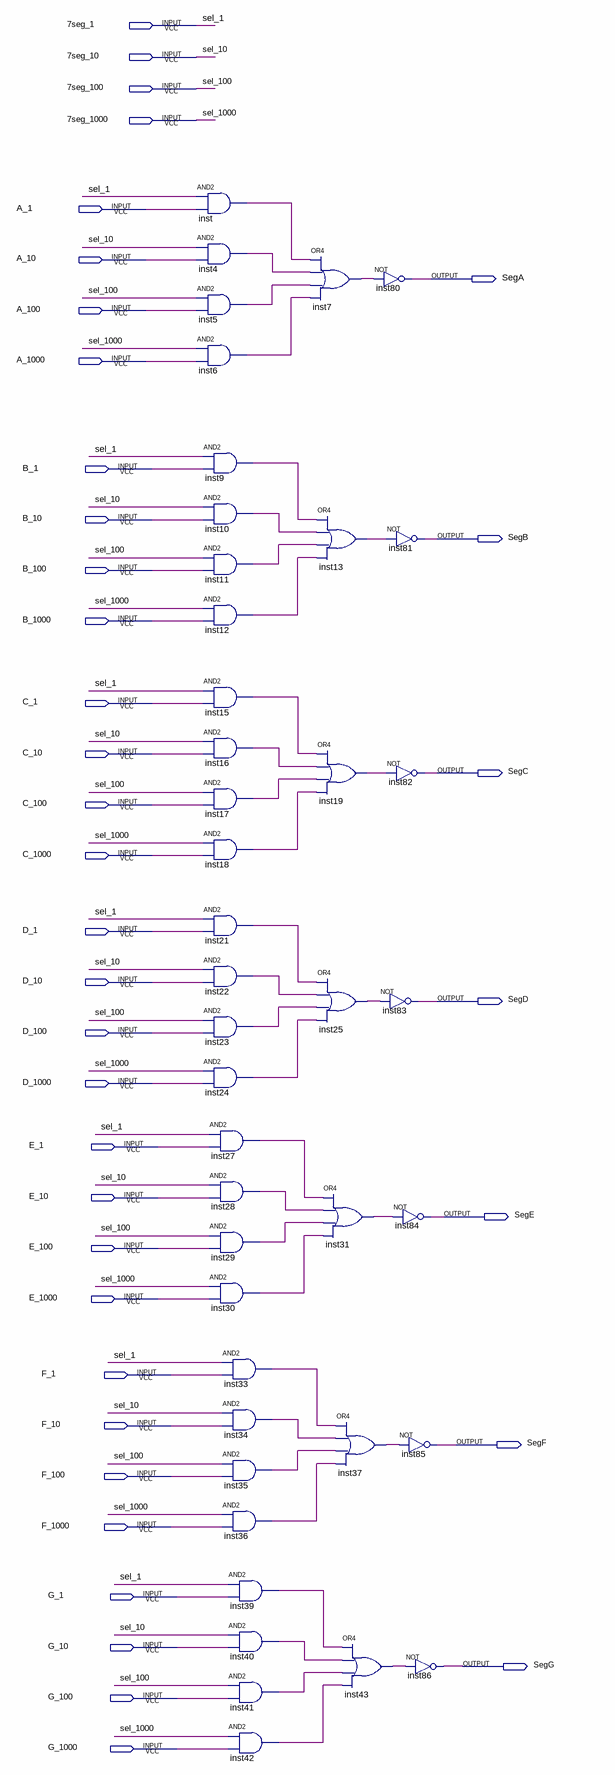
[diagram p0: schematic sheet]
// Quartus schematic Multiplexador.bdf as structural Verilog: 42 symbols, 39 pins
module Multiplexador (
  input  \7seg_1 ,
  input  \7seg_10 ,
  input  \7seg_100 ,
  input  \7seg_1000 ,
  input  A_1,
  input  A_10,
  input  A_100,
  input  A_1000,
  input  B_1,
  input  B_10,
  input  B_100,
  input  B_1000,
  input  C_1,
  input  C_10,
  input  C_100,
  input  C_1000,
  input  D_1,
  input  D_10,
  input  D_100,
  input  D_1000,
  input  E_1,
  input  E_10,
  input  E_100,
  input  E_1000,
  input  F_1,
  input  F_10,
  input  F_100,
  input  F_1000,
  input  G_1,
  input  G_10,
  input  G_100,
  input  G_1000,
  output SegA,
  output SegB,
  output SegC,
  output SegD,
  output SegE,
  output SegF,
  output SegG
);

  wire inst4_out, inst5_out, inst6_out, inst7_out, inst9_out, inst10_out, inst11_out, inst12_out, inst13_out,
       inst15_out, inst16_out, inst17_out, inst18_out, inst19_out, inst21_out, inst22_out, inst23_out,
       inst24_out, inst25_out, inst27_out, inst28_out, inst29_out, inst30_out, inst31_out, inst33_out,
       inst34_out, inst35_out, inst36_out, inst37_out, inst39_out, inst40_out, inst41_out, inst42_out,
       inst43_out, inst_out;

  and inst (inst_out, \7seg_1 , A_1);
  and inst4 (inst4_out, \7seg_10 , A_10);
  and inst5 (inst5_out, \7seg_100 , A_100);
  and inst6 (inst6_out, \7seg_1000 , A_1000);
  and inst9 (inst9_out, \7seg_1 , B_1);
  and inst10 (inst10_out, \7seg_10 , B_10);
  and inst11 (inst11_out, \7seg_100 , B_100);
  and inst12 (inst12_out, \7seg_1000 , B_1000);
  and inst15 (inst15_out, \7seg_1 , C_1);
  and inst16 (inst16_out, \7seg_10 , C_10);
  and inst17 (inst17_out, \7seg_100 , C_100);
  and inst18 (inst18_out, \7seg_1000 , C_1000);
  and inst21 (inst21_out, \7seg_1 , D_1);
  and inst22 (inst22_out, \7seg_10 , D_10);
  and inst23 (inst23_out, \7seg_100 , D_100);
  and inst24 (inst24_out, \7seg_1000 , D_1000);
  and inst27 (inst27_out, \7seg_1 , E_1);
  and inst28 (inst28_out, \7seg_10 , E_10);
  and inst29 (inst29_out, \7seg_100 , E_100);
  and inst30 (inst30_out, \7seg_1000 , E_1000);
  and inst33 (inst33_out, \7seg_1 , F_1);
  and inst34 (inst34_out, \7seg_10 , F_10);
  and inst35 (inst35_out, \7seg_100 , F_100);
  and inst36 (inst36_out, \7seg_1000 , F_1000);
  and inst39 (inst39_out, \7seg_1 , G_1);
  and inst40 (inst40_out, \7seg_10 , G_10);
  and inst41 (inst41_out, \7seg_100 , G_100);
  and inst42 (inst42_out, \7seg_1000 , G_1000);
  or inst7 (inst7_out, inst_out, inst4_out, inst5_out, inst6_out);
  or inst13 (inst13_out, inst9_out, inst10_out, inst11_out, inst12_out);
  or inst19 (inst19_out, inst15_out, inst16_out, inst17_out, inst18_out);
  or inst25 (inst25_out, inst21_out, inst22_out, inst23_out, inst24_out);
  or inst31 (inst31_out, inst27_out, inst28_out, inst29_out, inst30_out);
  not inst80 (SegA, inst7_out);
  or inst37 (inst37_out, inst33_out, inst34_out, inst35_out, inst36_out);
  or inst43 (inst43_out, inst39_out, inst40_out, inst41_out, inst42_out);
  not inst81 (SegB, inst13_out);
  not inst82 (SegC, inst19_out);
  not inst83 (SegD, inst25_out);
  not inst84 (SegE, inst31_out);
  not inst85 (SegF, inst37_out);
  not inst86 (SegG, inst43_out);

  // Other names for the same wires on the sheet: sel_1 = \7seg_1 ; sel_10 = \7seg_10 ; sel_100 = \7seg_100 ;
  //   sel_1000 = \7seg_1000 
endmodule
